# EAGLE design 06_SHL (EAGLE 7.5.0)
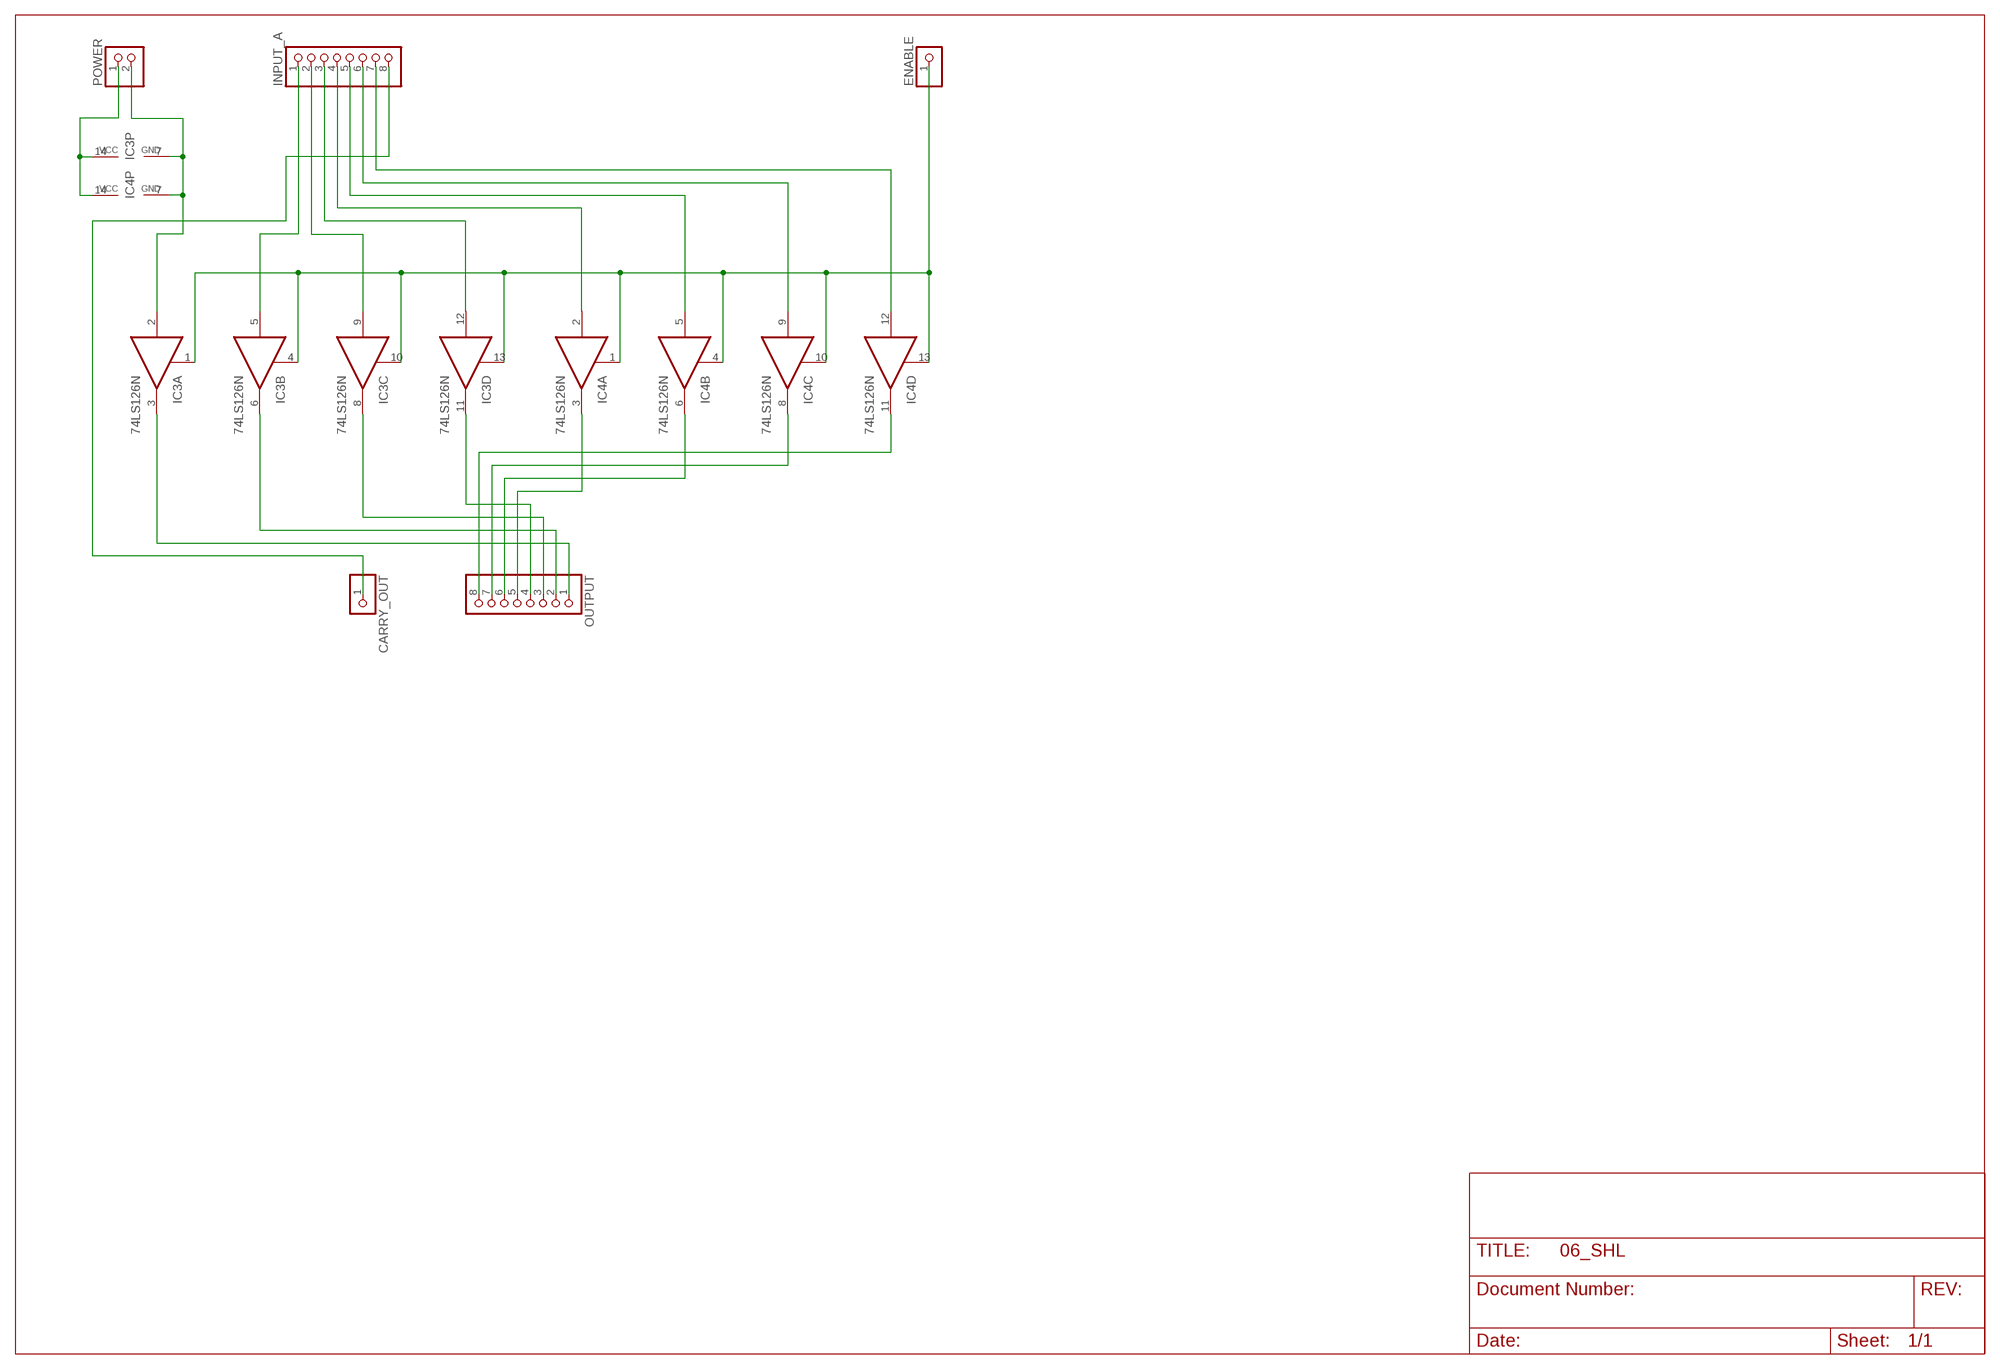
[diagram p0: schematic, sheet 1]

## Parts
CARRY_OUT  PINHD-1X1  [1X01]
ENABLE  PINHD-1X1  [1X01]
IC3  74LS126N  [DIL14]
IC4  74LS126N  [DIL14]
INPUT_A  PINHD-1X8  [1X08]
OUTPUT  PINHD-1X8  [1X08]
POWER  PINHD-1X2  [1X02]

## Nets
GND: IC3.2(A:I) IC3.7(P:GND) IC4.7(P:GND) POWER.2
N$1: IC3.5(B:I) INPUT_A.1
N$2: CARRY_OUT.1 INPUT_A.8
N$3: IC3.9(C:I) INPUT_A.2
N$9: IC4.5(B:I) INPUT_A.5
N$11: IC4.9(C:I) INPUT_A.6
N$13: IC4.12(D:I) INPUT_A.7
N$20: IC3.12(D:I) INPUT_A.3
N$21: IC4.2(A:I) INPUT_A.4
N$25: IC3.3(A:O) OUTPUT.1
N$26: IC3.6(B:O) OUTPUT.2
N$27: IC3.8(C:O) OUTPUT.3
N$28: IC3.11(D:O) OUTPUT.4
N$29: IC4.3(A:O) OUTPUT.5
N$30: IC4.6(B:O) OUTPUT.6
N$31: IC4.8(C:O) OUTPUT.7
N$32: IC4.11(D:O) OUTPUT.8
N$33: ENABLE.1 IC3.1(A:OE) IC3.4(B:OE) IC3.10(C:OE) IC3.13(D:OE) IC4.1(A:OE) IC4.4(B:OE) IC4.10(C:OE) IC4.13(D:OE)
VCC: IC3.14(P:VCC) IC4.14(P:VCC) POWER.1

## Library data of the parts
CARRY_OUT ENABLE = pinhead:PINHD-1X1: PIN HEADER
IC3 IC4 = 74xx-eu:74*126: Quad bus BUFFER, 3-state
INPUT_A OUTPUT = pinhead:PINHD-1X8: PIN HEADER
POWER = pinhead:PINHD-1X2: PIN HEADER

## Board
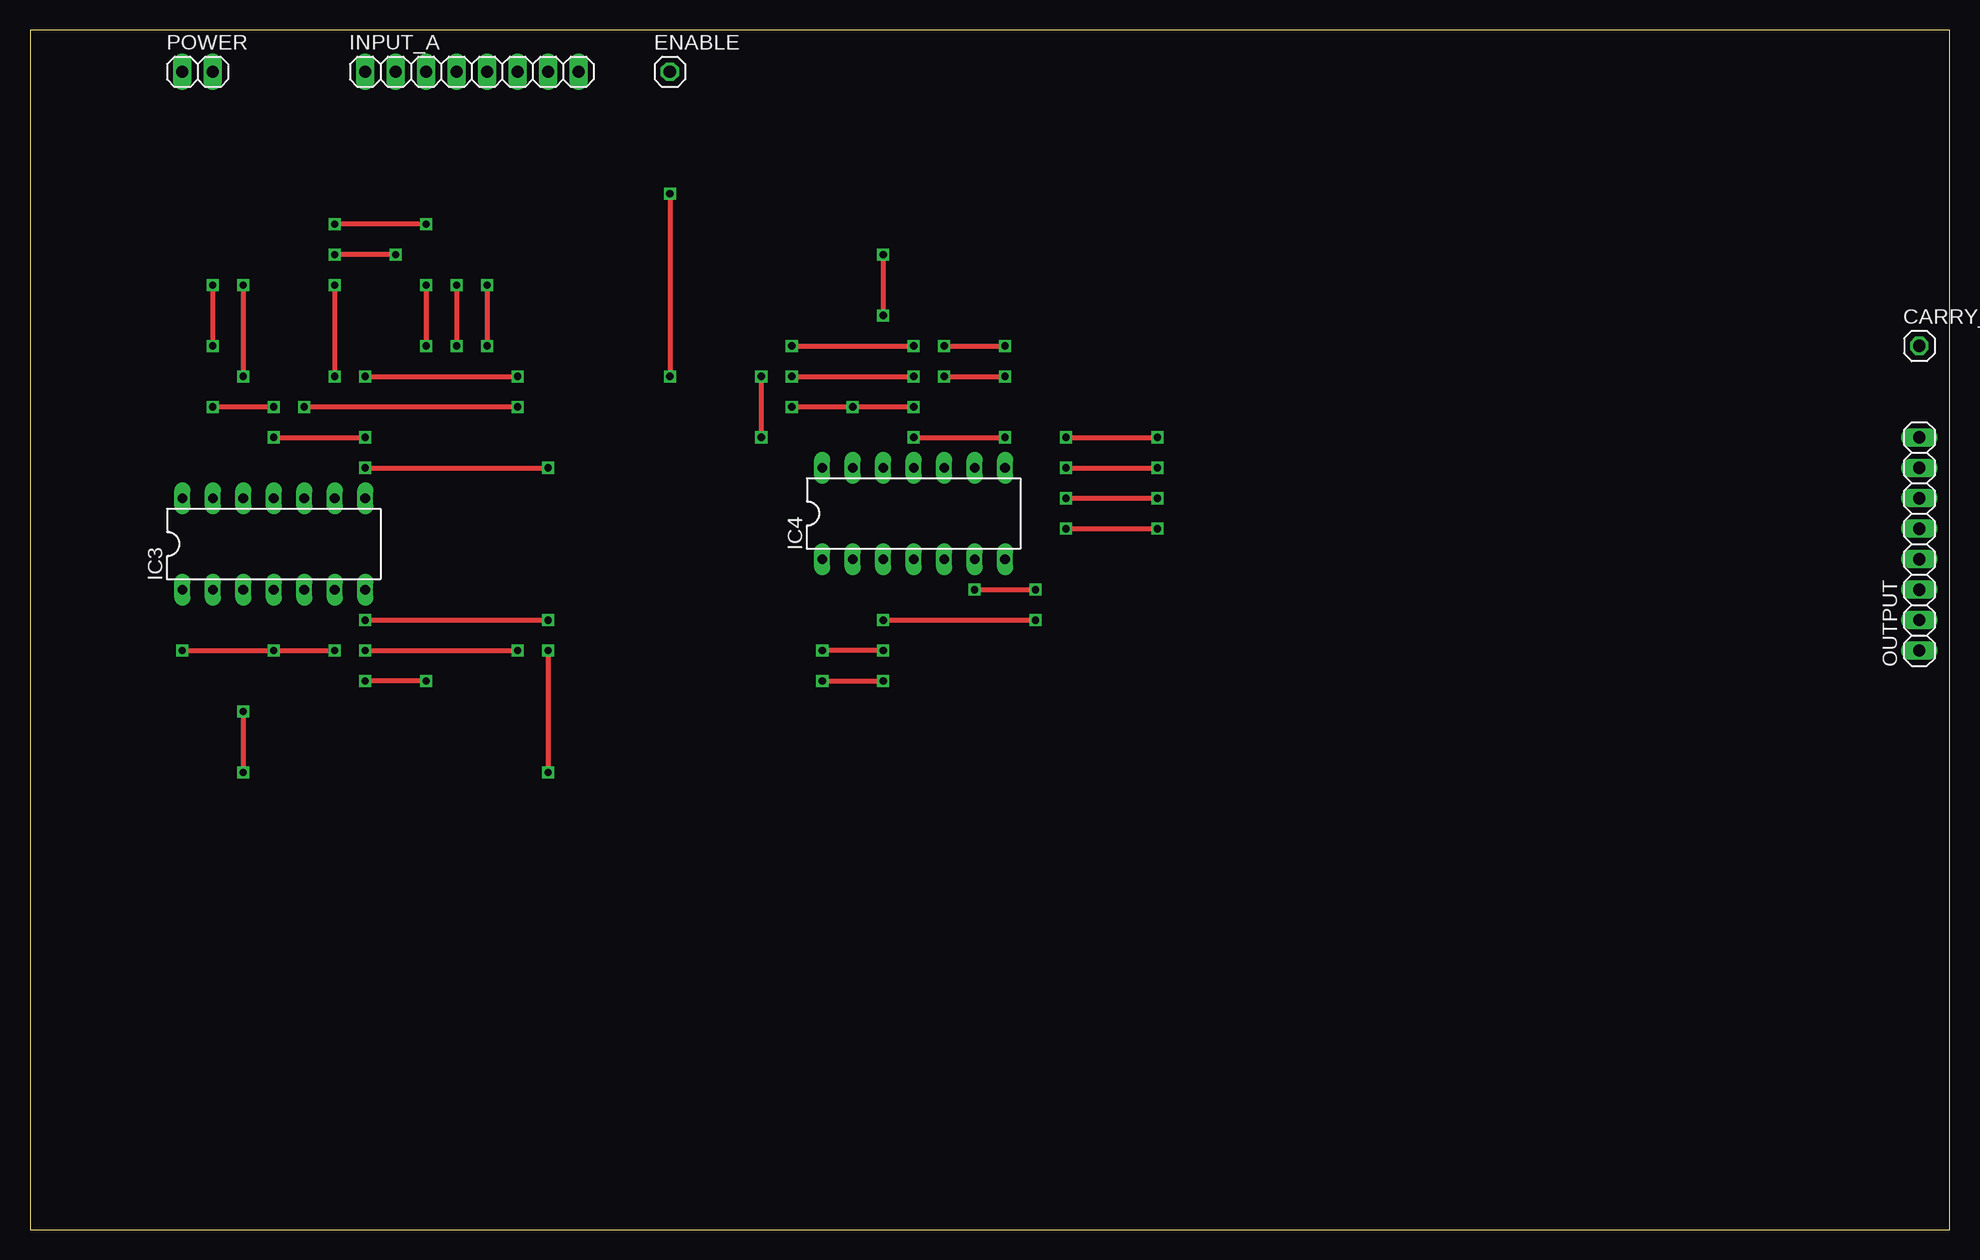
[diagram p1: board, top side]
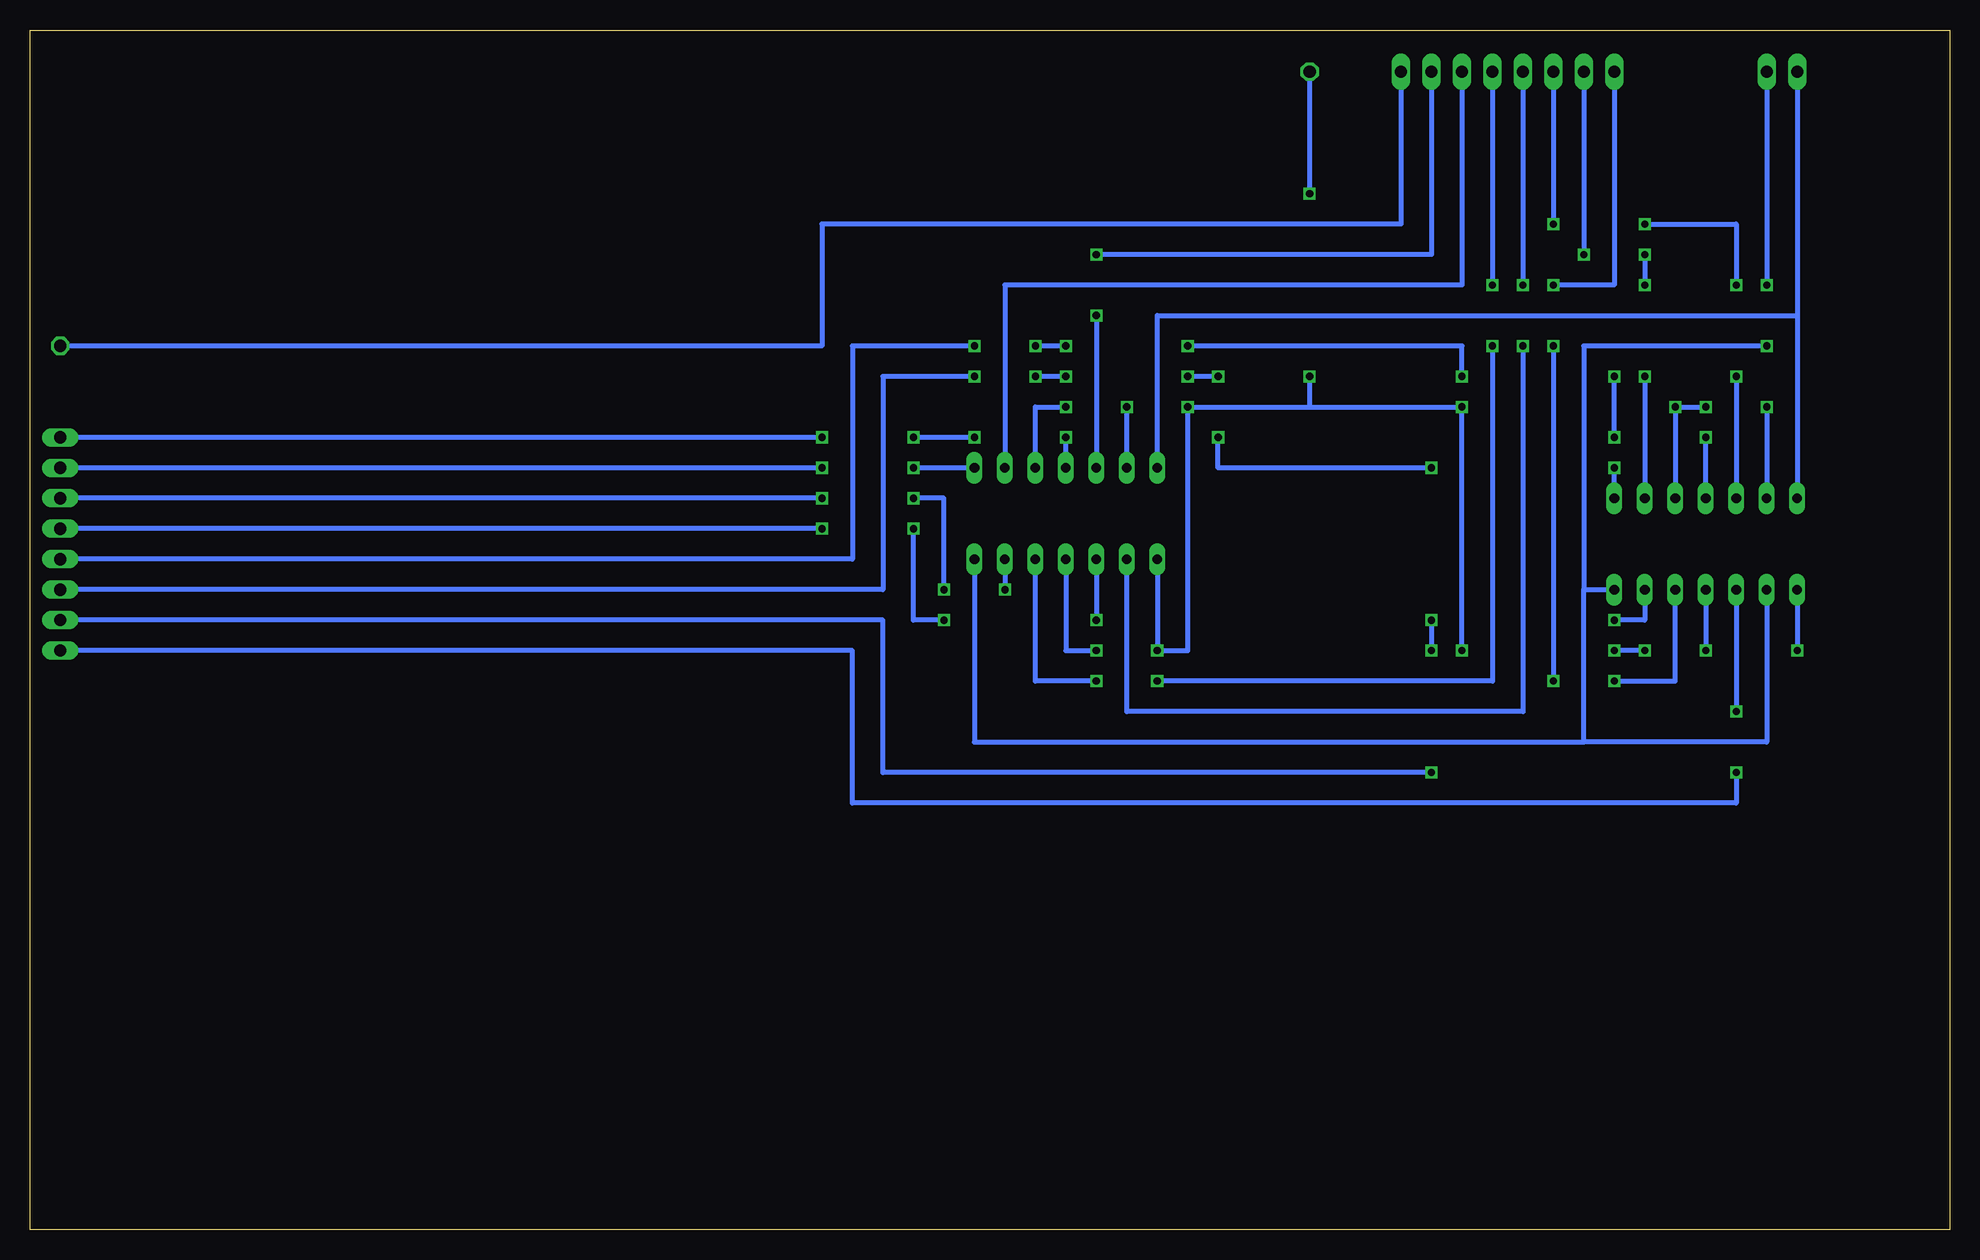
[diagram p2: board, bottom side, seen from below]

Size 160 x 100 mm. Coordinates in mm from the lower left corner, seen from the top.
Outline: 0,0 160,0 160,100 0,100 0,0
Copper layers (1*16): Top 0.035mm / dielectric 1.5mm / Bottom 0.035mm
Design rules "default": minimum track width 10mil, minimum drill 24mil, track to track 8mil, track to pad 8mil, pad to pad 8mil, via to via 8mil, smd to smd 8mil, copper to edge 40mil, drill to drill 8mil, minimum pad ring 10mil, minimum via ring 8mil, stop-mask expansion 4mil, vias tented up to drill 0mil, thermal gap 10mil

### Footprints (pad centres in the part's own frame; a part is rotated, then mirrored left to right if it is on the bottom)
1X01 = drill 1.016 octagon: 1 0,0
DIL14 = drill 0.813 long: 1 -7.62,-3.81; 2 -5.08,-3.81; 3 -2.54,-3.81; 4 0,-3.81; 5 2.54,-3.81; 6 5.08,-3.81; 7 7.62,-3.81; 8 7.62,3.81; 9 5.08,3.81; 10 2.54,3.81; 11 0,3.81; 12 -2.54,3.81; 13 -5.08,3.81; 14 -7.62,3.81
1X08 = drill 1.016 long: 1 -8.89,0; 2 -6.35,0; 3 -3.81,0; 4 -1.27,0; 5 1.27,0; 6 3.81,0; 7 6.35,0; 8 8.89,0
1X02 = drill 1.016 long: 1 -1.27,0; 2 1.27,0

### Placement (x,y rotation side)
CARRY_OUT  157.48,73.66 0 top
ENABLE  53.34,96.52 0 top
IC3  20.32,57.15 0 top
IC4  73.66,59.69 0 top
INPUT_A  36.83,96.52 0 top
OUTPUT  157.48,57.15 90 top
POWER  13.97,96.52 0 top

### Tracks (layer width: path | path; a pad name or v marks a point on that pad's centre or on a via)
GND  (via drill 0.6)
  Top 0.406: v15.24,78.74 v15.24,73.66
  Bottom 0.406: POWER.2 v15.24,78.74 | v15.24,73.66 30.48,73.66 30.48,53.34 | 30.48,53.34 IC3.7 | IC3.2 15.24,40.64 30.48,40.64 | 30.48,40.64 30.48,53.34 | IC4.7 81.28,40.64 30.48,40.64
N$1  (via drill 0.6)
  Top 0.406: v33.02,78.74 v33.02,73.66 | v33.02,45.72 v27.94,45.72
  Bottom 0.406: INPUT_A.1 27.94,78.74 v33.02,78.74 | v33.02,73.66 v33.02,45.72 | v27.94,45.72 22.86,45.72 IC3.5
N$2
  Bottom 0.406: INPUT_A.8 45.72,83.82 93.98,83.82 93.98,73.66 CARRY_OUT.1
N$3  (via drill 0.6)
  Top 0.406: v30.48,81.28 v25.4,81.28 | v25.4,78.74 v25.4,71.12
  Bottom 0.406: INPUT_A.2 v30.48,81.28 | v25.4,81.28 v25.4,78.74 | v25.4,71.12 IC3.9
N$9  (via drill 0.6)
  Top 0.406: v38.1,78.74 v38.1,73.66 | v66.04,45.72 v71.12,45.72
  Bottom 0.406: INPUT_A.5 v38.1,78.74 | v38.1,73.66 38.1,45.72 v66.04,45.72 | v71.12,45.72 76.2,45.72 IC4.5
N$11
  Bottom 0.406: INPUT_A.6 40.64,78.74 78.74,78.74 IC4.9
N$13  (via drill 0.6)
  Top 0.406: v71.12,81.28 v71.12,76.2
  Bottom 0.406: INPUT_A.7 43.18,81.28 v71.12,81.28 | v71.12,76.2 IC4.12
N$20  (via drill 0.6)
  Top 0.406: v33.02,83.82 v25.4,83.82 | v17.78,78.74 v17.78,71.12
  Bottom 0.406: INPUT_A.3 v33.02,83.82 | v25.4,83.82 17.78,83.82 v17.78,78.74 | v17.78,71.12 IC3.12
N$21  (via drill 0.6)
  Top 0.406: v35.56,78.74 v35.56,73.66
  Bottom 0.406: INPUT_A.4 v35.56,78.74 | v35.56,73.66 35.56,43.18 68.58,43.18 IC4.2
N$25  (via drill 0.6)
  Top 0.406: v17.78,43.18 v17.78,38.1
  Bottom 0.406: IC3.3 v17.78,43.18 | OUTPUT.1 91.44,48.26 91.44,35.56 17.78,35.56 v17.78,38.1
N$26  (via drill 0.6)
  Top 0.406: v27.94,50.8 v43.18,50.8 | v43.18,48.26 v43.18,38.1
  Bottom 0.406: IC3.6 25.4,50.8 v27.94,50.8 | v43.18,50.8 v43.18,48.26 | v43.18,38.1 88.9,38.1 88.9,50.8 OUTPUT.2
N$27  (via drill 0.6)
  Top 0.406: v27.94,63.5 v43.18,63.5 | v60.96,66.04 v60.96,71.12 | v63.5,71.12 v73.66,71.12 | v76.2,71.12 v81.28,71.12
  Bottom 0.406: IC3.8 v27.94,63.5 | v43.18,63.5 60.96,63.5 v60.96,66.04 | v60.96,71.12 v63.5,71.12 | v73.66,71.12 v76.2,71.12 | v81.28,71.12 88.9,71.12 88.9,53.34 OUTPUT.3
N$28  (via drill 0.6)
  Top 0.406: v20.32,66.04 v27.94,66.04 | v27.94,71.12 v40.64,71.12 | v63.5,73.66 v73.66,73.66 | v76.2,73.66 v81.28,73.66
  Bottom 0.406: IC3.11 v20.32,66.04 | v27.94,66.04 v27.94,71.12 | v40.64,71.12 40.64,73.66 v63.5,73.66 | v73.66,73.66 v76.2,73.66 | v81.28,73.66 91.44,73.66 91.44,55.88 OUTPUT.4
N$29  (via drill 0.6)
  Top 0.406: v71.12,50.8 v83.82,50.8 | v86.36,58.42 v93.98,58.42
  Bottom 0.406: IC4.3 v71.12,50.8 | v83.82,50.8 86.36,50.8 v86.36,58.42 | v93.98,58.42 OUTPUT.5
N$30  (via drill 0.6)
  Top 0.406: v78.74,53.34 v83.82,53.34 | v86.36,60.96 v93.98,60.96
  Bottom 0.406: IC4.6 v78.74,53.34 | v83.82,53.34 83.82,60.96 v86.36,60.96 | v93.98,60.96 OUTPUT.6
N$31  (via drill 0.6)
  Top 0.406: v86.36,63.5 v93.98,63.5
  Bottom 0.406: IC4.8 v86.36,63.5 | v93.98,63.5 OUTPUT.7
N$32  (via drill 0.6)
  Top 0.406: v73.66,66.04 v81.28,66.04 | v86.36,66.04 v93.98,66.04
  Bottom 0.406: IC4.11 v73.66,66.04 | v81.28,66.04 v86.36,66.04 | v93.98,66.04 OUTPUT.8
N$33  (via drill 0.6)
  Top 0.406: v53.34,86.36 v53.34,71.12 | v40.64,68.58 v22.86,68.58 | v20.32,68.58 v15.24,68.58 | v12.7,48.26 v20.32,48.26 v25.4,48.26 | v27.94,48.26 v40.64,48.26 | v63.5,68.58 v68.58,68.58 v73.66,68.58 | v71.12,48.26 v66.04,48.26
  Bottom 0.406: ENABLE.1 v53.34,86.36 | v53.34,71.12 53.34,68.58 | 53.34,68.58 v40.64,68.58 v40.64,48.26 | v20.32,68.58 v22.86,68.58 IC3.10 | v15.24,68.58 IC3.13 | IC3.1 v12.7,48.26 | v25.4,48.26 v27.94,48.26 | IC3.4 v20.32,48.26 | IC4.13 v68.58,68.58 | 53.34,68.58 v63.5,68.58 63.5,48.26 v66.04,48.26 IC4.1 | IC4.10 76.2,68.58 v73.66,68.58 | IC4.4 73.66,48.26 v71.12,48.26
VCC
  Bottom 0.406: POWER.1 12.7,76.2 | 12.7,76.2 IC3.14 | IC4.14 66.04,76.2 12.7,76.2